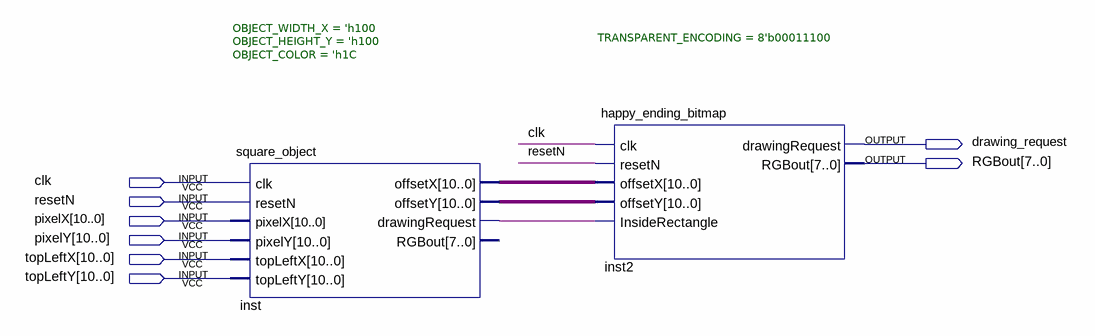
[diagram p0: schematic sheet]
// Quartus schematic happy_ending_block.bdf as structural Verilog: 2 symbols, 8 pins
module happy_ending_block (
  input  clk,
  input  resetN,
  input  [10:0] pixelX,
  input  [10:0] pixelY,
  input  [10:0] topLeftX,
  input  [10:0] topLeftY,
  output drawing_request,
  output [7:0] RGBout
);

  wire inst_drawingrequest;
  wire [10:0] inst_offsetx, inst_offsety;

  square_object #(.OBJECT_WIDTH_X('h100), .OBJECT_HEIGHT_Y('h100), .OBJECT_COLOR('h1C)) inst (
    .clk(clk), .resetN(resetN), .pixelX(pixelX), .pixelY(pixelY), .topLeftX(topLeftX), .topLeftY(topLeftY),
    .offsetX(inst_offsetx), .offsetY(inst_offsety), .drawingRequest(inst_drawingrequest));  // open: RGBout
  happy_ending_bitmap #(.TRANSPARENT_ENCODING(8'b00011100)) inst2 (
    .clk(clk), .resetN(resetN), .offsetX(inst_offsetx), .offsetY(inst_offsety),
    .InsideRectangle(inst_drawingrequest), .drawingRequest(drawing_request), .RGBout(RGBout));
endmodule
